# Altium project WHEY_AGR_AGR_VAI.PrjPcb
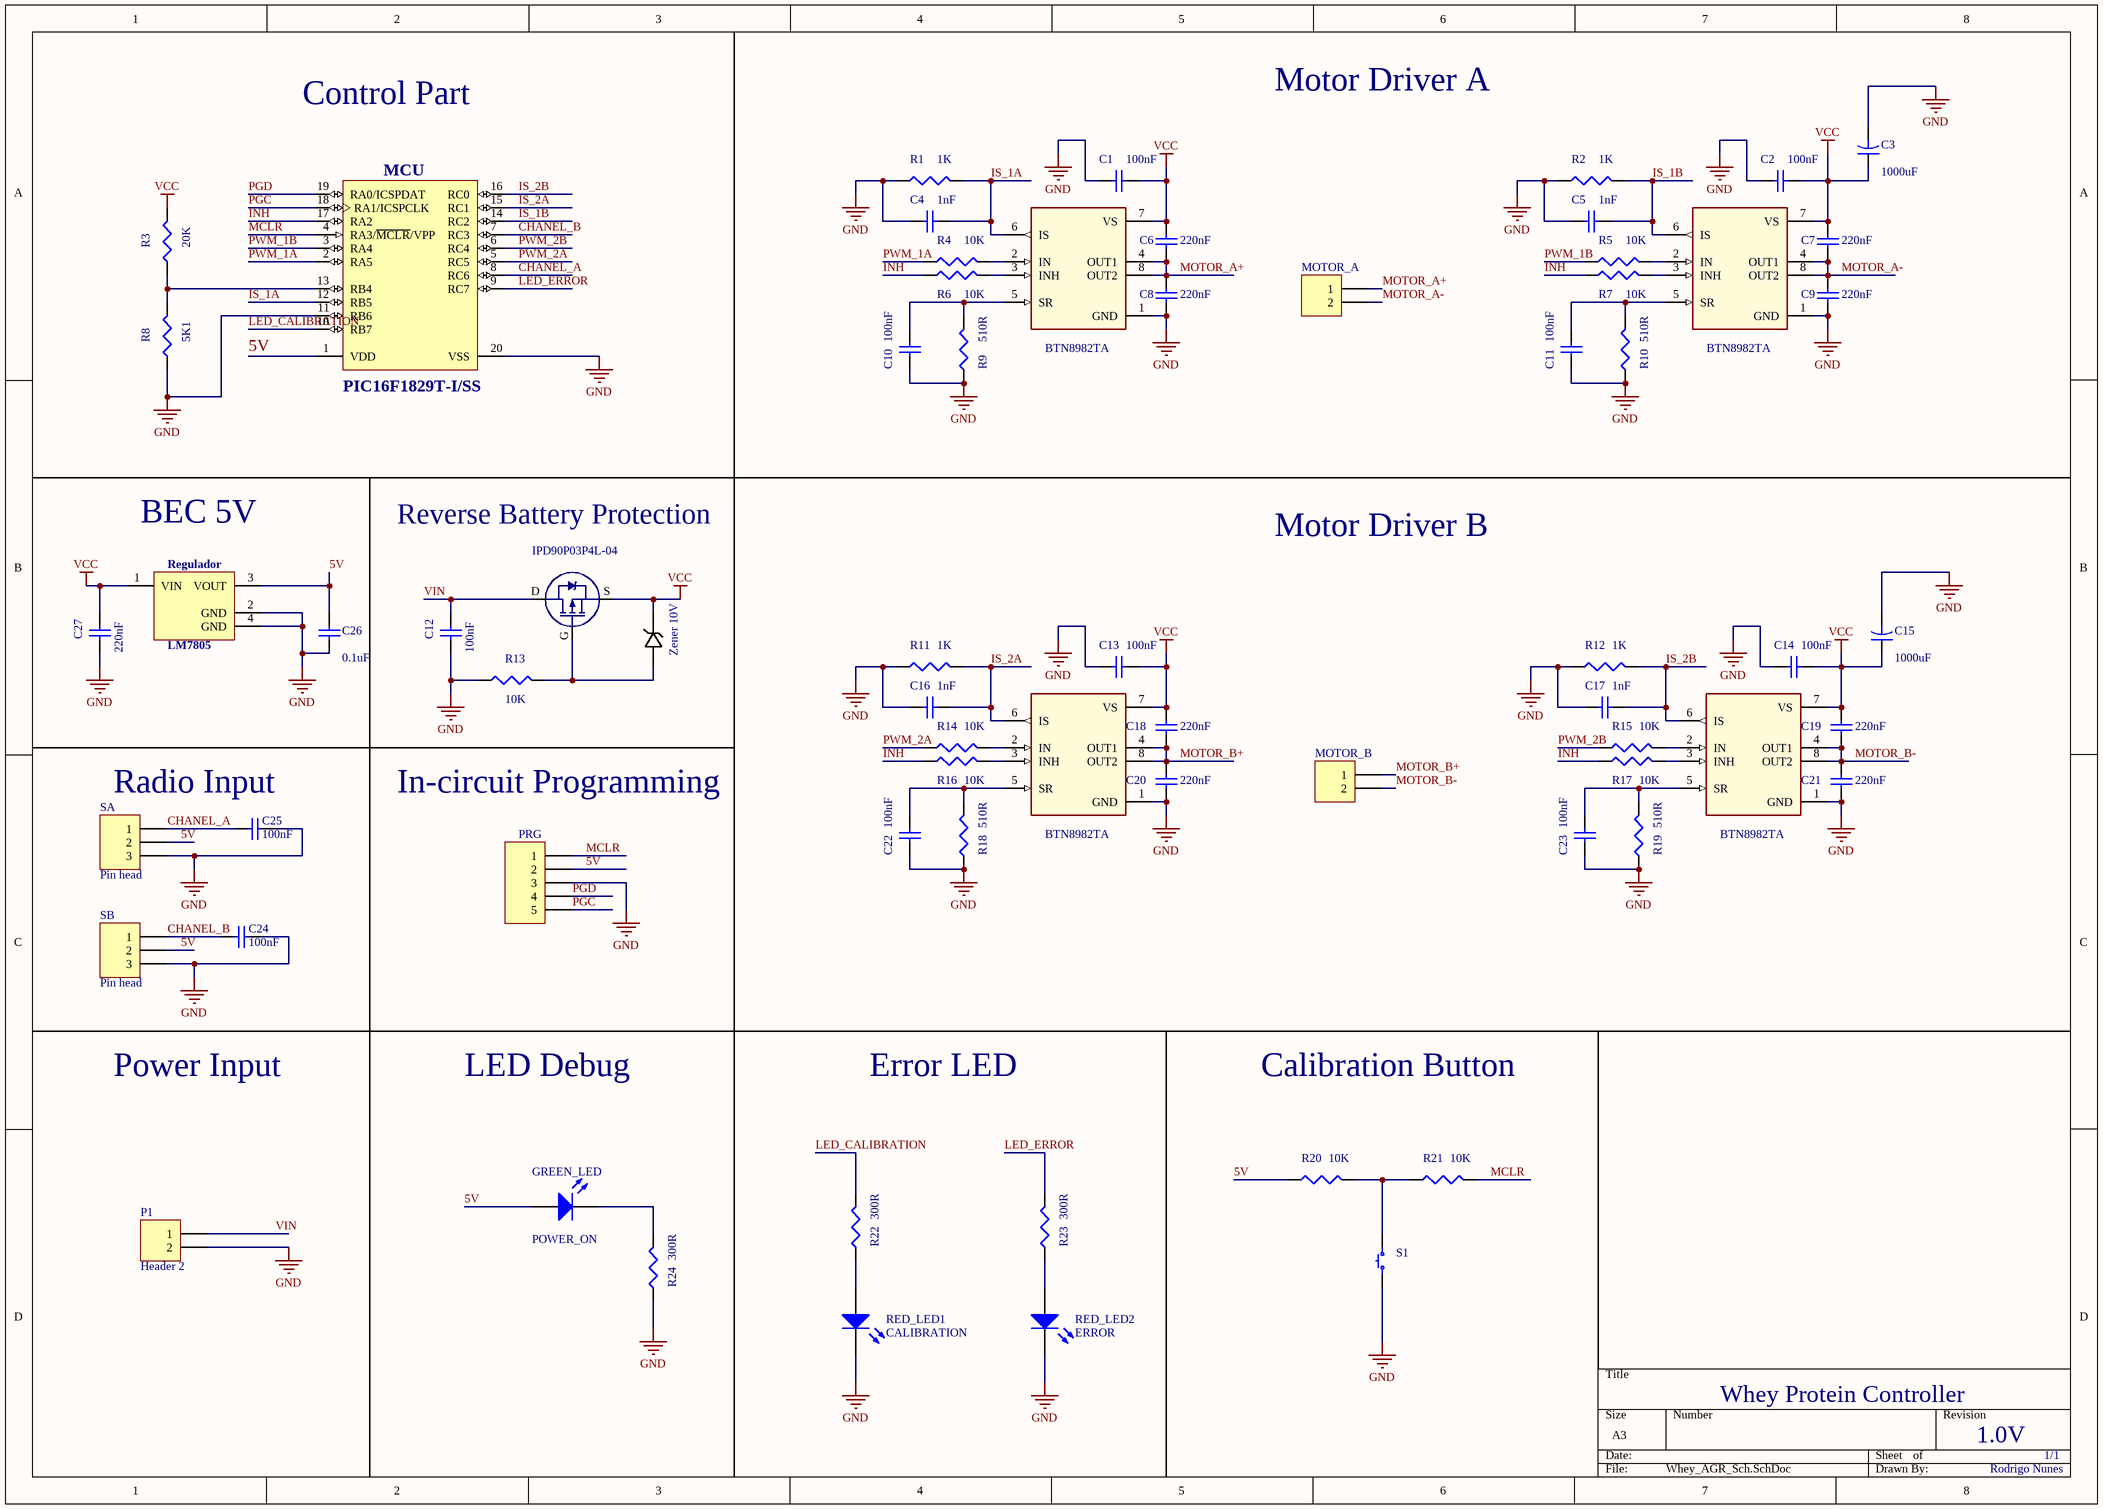
[diagram p0: Whey_AGR_Sch.SchDoc]
1 sheet, 69 parts. Net scope: global (net labels, ports and power ports of the same name join across sheets).
Board file: Whey_AGR_AGR_PCB.PcbDoc

## Sheet Whey_AGR_Sch.SchDoc
size A3

### Parts
C1  value 100nF  [C1206]  (hidden comment: Cap Semi)
C2  value 100nF  [C1206]  (hidden comment: Cap Semi)
C3  1000uF  [CAPR5-4X5]
C4  value 1nF  [C1206]  (hidden comment: Cap Semi)
C5  value 1nF  [C1206]  (hidden comment: Cap Semi)
C6  value 220nF  [C1206]  (hidden comment: Cap Semi)
C7  value 220nF  [C1206]  (hidden comment: Cap Semi)
C8  value 220nF  [C1206]  (hidden comment: Cap Semi)
C9  value 220nF  [C1206]  (hidden comment: Cap Semi)
C10  value 100nF  [C1206]  (hidden comment: Cap Semi)
C11  value 100nF  [C1206]  (hidden comment: Cap Semi)
C12  value 100nF  [C1206]  (hidden comment: Cap Semi)
C13  value 100nF  [C1206]  (hidden comment: Cap Semi)
C14  value 100nF  [C1206]  (hidden comment: Cap Semi)
C15  value 1000uF  [CAPR5-4X5]  (hidden comment: Cap2)
C16  value 1nF  [C1206]  (hidden comment: Cap Semi)
C17  value 1nF  [C1206]  (hidden comment: Cap Semi)
C18  value 220nF  [C1206]  (hidden comment: Cap Semi)
C19  value 220nF  [C1206]  (hidden comment: Cap Semi)
C20  value 220nF  [C1206]  (hidden comment: Cap Semi)
C21  value 220nF  [C1206]  (hidden comment: Cap Semi)
C22  value 100nF  [C1206]  (hidden comment: Cap Semi)
C23  value 100nF  [C1206]  (hidden comment: Cap Semi)
C24  value 100nF  [C1206]  (hidden comment: Cap Semi)
C25  value 100nF  [C1206]  (hidden comment: Cap Semi)
C26  value 0.1uF  [C1206]
C27  value 220nF  [C1206]  (hidden comment: Cap Semi)
GREEN_LED  POWER_ON  [3.2X1.6X1.1]
IPD90P03P4L-04  IPD50P04P4  [TO-252]  (value not drawn)
MCU  PIC16F1829T-I/SS  [MCHP-SSOP-SS20_N]
MOTOR_A  Header 2  [HDR1X2]  (value not drawn)
MOTOR_B  Header 2  [HDR1X2]  (value not drawn)
P1  Header 2  [HDR1X2]
PRG  Header 5  [HDR1X5]  (value not drawn)
R1  value 1K  [J1-0603]  (hidden comment: Res3)
R2  value 1K  [J1-0603]  (hidden comment: Res3)
R3  value 20K  [J1-0603]  (hidden comment: Res3)
R4  value 10K  [J1-0603]  (hidden comment: Res3)
R5  value 10K  [J1-0603]  (hidden comment: Res3)
R6  value 10K  [J1-0603]  (hidden comment: Res3)
R7  value 10K  [J1-0603]  (hidden comment: Res3)
R8  value 5K1  [J1-0603]  (hidden comment: Res3)
R9  value 510R  [J1-0603]  (hidden comment: Res3)
R10  value 510R  [J1-0603]  (hidden comment: Res3)
R11  value 1K  [J1-0603]  (hidden comment: Res3)
R12  value 1K  [J1-0603]  (hidden comment: Res3)
R13  value 10K  [J1-0603]  (hidden comment: Res3)
R14  value 10K  [J1-0603]  (hidden comment: Res3)
R15  value 10K  [J1-0603]  (hidden comment: Res3)
R16  value 10K  [J1-0603]  (hidden comment: Res3)
R17  value 10K  [J1-0603]  (hidden comment: Res3)
R18  value 510R  [J1-0603]  (hidden comment: Res3)
R19  value 510R  [J1-0603]  (hidden comment: Res3)
R20  value 10K  [J1-0603]  (hidden comment: Res3)
R21  value 10K  [J1-0603]  (hidden comment: Res3)
R22  value 300R  [J1-0603]  (hidden comment: Res3)
R23  value 300R  [J1-0603]  (hidden comment: Res3)
R24  value 300R  [J1-0603]  (hidden comment: Res3)
RED_LED1  CALIBRATION  [3.2X1.6X1.1]
RED_LED2  ERROR  [3.2X1.6X1.1]
Regulador  LM7805  [SOT223]
S1  FSMSMTR  [TE FSMSMTR]  (value not drawn)
SA  Pin head  [HDR1X3]
SB  Pin head  [HDR1X3]
U1  BTN8982TA  [TO127P1500X440-8N-1]
U2  BTN8982TA  [TO127P1500X440-8N-1]
U3  BTN8982TA  [TO127P1500X440-8N-1]
U4  BTN8982TA  [TO127P1500X440-8N-1]
Zener_10V  BZT52HC10WF-7  [SOD123]  (value not drawn)

### Nets
GND: C1.1 C2.1 C3.2 C4.1 C5.1 C8.1 C9.1 C10.1 C11.1 C12.1 C13.1 C14.1 C15.2 C16.1 C17.1 C20.1 C21.1 C22.1 C23.1 C24.1 C25.2 C26.2 C27.1 MCU.11(RB6) MCU.20(VSS) P1.2 PRG.3 R1.1 R2.1 R8.1 R9.1 R10.1 R11.1 R12.1 R13.1 R18.1 R19.1 R24.1 RED_LED1.2(K) RED_LED2.2(K) Regulador.2(GND) Regulador.4(GND) S1.1 SA.3 SB.3 U1.1(GND) U2.1(GND) U3.1(GND) U4.1(GND)
VCC: C1.2 C2.2 C3.1 C6.2 C7.2 C13.2 C14.2 C15.1 C18.2 C19.2 C27.2 IPD90P03P4L-04.S R3.2 Regulador.1(VIN) U1.7(VS) U2.7(VS) U3.7(VS) U4.7(VS) Zener_10V.K
5V: C26.1 GREEN_LED.1(A) MCU.1(VDD) PRG.2 R20.1 Regulador.3(VOUT) SA.2 SB.2
CHANEL_A: C25.1 MCU.8(RC6) SA.1
CHANEL_B: C24.2 MCU.7(RC3) SB.1
INH: MCU.17(RA2) R6.1 R7.1 R16.1 R17.1
IS_1A: C4.2 MCU.12(RB5) R1.2 U1.6(IS)
IS_1B: C5.2 MCU.14(RC2) R2.2 U2.6(IS)
IS_2A: C16.2 MCU.15(RC1) R11.2 U3.6(IS)
IS_2B: C17.2 MCU.16(RC0) R12.2 U4.6(IS)
LED_CALIBRATION: MCU.10(RB7) R22.2
LED_ERROR: MCU.9(RC7) R23.2
MCLR: MCU.4(RA3/~{MCLR}/VPP) PRG.1 R21.2
MOTOR_A+: C6.1 C8.2 MOTOR_A.1 U1.4(OUT1) U1.8(OUT2)
MOTOR_A-: C7.1 C9.2 MOTOR_A.2 U2.4(OUT1) U2.8(OUT2)
MOTOR_B+: C18.1 C20.2 MOTOR_B.1 U3.4(OUT1) U3.8(OUT2)
MOTOR_B-: C19.1 C21.2 MOTOR_B.2 U4.4(OUT1) U4.8(OUT2)
PGC: MCU.18(RA1/ICSPCLK) PRG.5
PGD: MCU.19(RA0/ICSPDAT) PRG.4
PWM_1A: MCU.2(RA5) R4.1
PWM_1B: MCU.3(RA4) R5.1
PWM_2A: MCU.5(RC5) R14.1
PWM_2B: MCU.6(RC4) R15.1
VIN: C12.2 IPD90P03P4L-04.D P1.1
NetC10_2: C10.2 R9.2 U1.5(SR)
NetC11_2: C11.2 R10.2 U2.5(SR)
NetC22_2: C22.2 R18.2 U3.5(SR)
NetC23_2: C23.2 R19.2 U4.5(SR)
NetGREEN_LED_2: GREEN_LED.2(K) R24.2
NetIPD90P03P4L-04_G: IPD90P03P4L-04.G R13.2 Zener_10V.A
NetMCU_13: MCU.13(RB4) R3.1 R8.2
NetR4_2: R4.2 U1.2(IN)
NetR5_2: R5.2 U2.2(IN)
NetR6_2: R6.2 U1.3(INH)
NetR7_2: R7.2 U2.3(INH)
NetR14_2: R14.2 U3.2(IN)
NetR15_2: R15.2 U4.2(IN)
NetR16_2: R16.2 U3.3(INH)
NetR17_2: R17.2 U4.3(INH)
NetR20_2: R20.2 R21.1 S1.2
NetR22_1: R22.1 RED_LED1.1(A)
NetR23_1: R23.1 RED_LED2.1(A)

### Notes on the sheet
- Control Part
- Motor Driver A
- BEC 5V
- Reverse Battery Protection
- Motor Driver B
- Radio Input
- In-circuit Programming
- Power Input
- LED Debug
- Error LED
- Calibration Button
- Whey Protein Controller
- 1.0V
- 1/1
- Rodrigo Nunes

### Library data of the parts
C1 C2 C4-C14 C16-C27 = Cap Semi: Capacitor (Semiconductor SIM Model); Published: 8-Jun-2000; LatestRevisionDate: 29-May-2009; LatestRevisionNote: IPC-7351 Footprint Added.; PackageReference: C1206; Publisher: Altium Limited; PackageDescription: Chip Capacitor
C3 C15 = Cap2: Capacitor; Published: 23-Sep-2002; PackageReference: CAPR5-4X5; Publisher: Altium Limited; PackageDescription: Capacitor; 2 Leads
  C3: Value: 1000uF
GREEN_LED RED_LED1 RED_LED2 = LED2: Typical RED, GREEN, YELLOW, AMBER GaAs LED; Published: 8-Jun-2000; LatestRevisionDate: 17-Jul-2002; LatestRevisionNote: Re-released for DXP Platform.; PackageVersion: Feb-2002; PackageReference: 3.2X1.6X1.1; Publisher: Altium Limited; PackageDescription: SM LED; 2 Flat Leads
IPD90P03P4L-04 = IPD50P04P4: MOSFET P-Ch -40V -50A DPAK-2 OptiMOS-P2; pin to pad: D>4 G>1 S>3
MCU = PIC16F1829T-I/SS: Flash Microcontroller with XLP Technology, 32 MHz, 17 I/O, -40 to 85 degC, 20-pin SSOP (SS20), Tape and Reel; Manufacturer: Microchip; # of A/D Channels: 12; Digital Communication: 1 -A/E/USART, 2 -MSSP(SPI/I2C); EEPROM Data Memory (bytes): 256; I/O Pins: 17; Internal Oscillator: 32 MHz, 31 kHz; Max. CPU Speed MHz: 32; Operation Voltage Range: 1.8V - 5.5V; Packing: T/R; Program Memory KBytes: 14; Program Memory KWords: 8; RAM: 1024; Timers: 4 - 8-bit, 1 - 16-bit; DatasheetVersion: Rev. C; PackageVersion: C04-072B, 12/2012; PackageReference: SSOP-SS20; PackageDescription: 20-Lead Plastic Shrink Small Outline, 5.3 x 7.2 mm Body, 0.65 mm Pitch; Supplier 1: Digi-Key; Supplier Part Number 1: PIC16F1829T-I/SS-ND; Supplier 2: Newark; Supplier Part Number 2: 82R4387; Supplier 3: Mouser; Supplier Part Number 3: 579-PIC16F1829T-I/SS; Memory Type: Flash; RoHS: TRUE; Mounting Technology: Surface Mount; PartNumber: PIC16F1829T-I/SS; ComponentLink1Description: Datasheet; ComponentLink1URL: http://ww1.microchip.com/downloads/en/DeviceDoc/41440C.pdf; ComponentLink2Description: Package Specification; ComponentLink2URL: http://www.microchip.com/stellent/groups/techpub_sg/documents/packagingspec/en012702.pdf; ComponentLink3Description: URL Link1; ComponentLink3URL: Product URL:http://www.microchip.com/datasheet/PIC16F1829
MOTOR_A MOTOR_B P1 = Header 2: Header, 2-Pin; LatestRevisionDate: 17-Jul-2002; LatestRevisionNote: Re-released for DXP Platform.; Publisher: Altium Limited
PRG = Header 5: Header, 5-Pin; LatestRevisionDate: 17-Jul-2002; LatestRevisionNote: Re-released for DXP Platform.; Publisher: Altium Limited
R1 R2 R4-R7 R11-R17 R20 R21 = Res3: Resistor; Published: 8-Jun-2000; LatestRevisionDate: 29-May-2009; LatestRevisionNote: IPC-7351 Footprint Added.; PackageReference: J1-0603; Publisher: Altium Limited; PackageDescription: Chip Resistor
R3 R8-R10 R18 R19 R22-R24 = Res3: Resistor_SMD; Published: 8-Jun-2000; LatestRevisionDate: 29-May-2009; LatestRevisionNote: IPC-7351 Footprint Added.; PackageReference: J1-0603; Publisher: Altium Limited; PackageDescription: Chip Resistor
Regulador = LM7805MP/NOPB: 5V Regulator, 3-Pin SOT-223, Extended Temperature, Tape and Reel; Published: 29-Jan-2009; DatasheetVersion: revA, Aug-2007; PackageVersion: revBB, Aug-2009; PackageReference: SOT-223-DB3; Publisher: Altium Limited; PackageDescription: 3-Lead Plastic Small Outline Transistor (DB) [SOT-223]; Supplier 1: Digi-Key; Supplier Part Number 1: MCP1824ST-1202E/DBTR-ND; Supplier 2: Digi-Key; Supplier Part Number 2: MCP1824ST-1202E/DBCT-ND; Supplier 3: Digi-Key; Supplier Part Number 3: MCP1824ST-1202E/DBDKR-ND; Supplier 4: Farnell; Supplier Part Number 4: 1675417; ComponentLink1Description: Datasheet; ComponentLink1URL: http://ww1.microchip.com/downloads/en/DeviceDoc/22070a.pdf; ComponentLink2Description: Packaging Specification; ComponentLink2URL: http://www.microchip.com/stellent/groups/techpub_sg/documents/packagingspec/en012702.pdf; ComponentLink3Description: Microchip.com Home; ComponentLink3URL: http://www.microchip.com/
S1 = FSMSMTR: SWITCH TACTILE SPST-NO 0.05A 24V; Manufacturer: TE Connectivity Alcoswitch Switches; Switch Function: Off-Mom; Contact Rating @ Voltage: 0.05A @ 24VDC; Actuator Type: Standard; Actuator Orientation: Top Actuated; Illumination: Non-Illuminated; Operating Force: 180gf; Switch Travel: 0.25mm; Mechanical Life: 20,000 Cycles; Part Number: FSMSMTR; PartId: 8251; Supplier 1: Digi-Key; Supplier Part Number 1: 450-1758-2-ND; ComponentLink1Description: Datasheet; ComponentLink1URL: http://www.te.com/commerce/DocumentDelivery/DDEController?Action=srchrtrv&DocNm=1437566-3&DocType=Customer+Drawing&DocLang=English; ComponentLink2Description: Digi-Key Listing; ComponentLink2URL: http://www.digikey.com/product-detail/en/FSMSMTR/450-1758-2-ND/529671; Price: 0.175; Circuit: SPST-NO; Illumination Voltage: -; Illumination Type, Colour: -; Operating Temperature: -35C ~ 85C
SA SB = Header 3: Header, 3-Pin; LatestRevisionDate: 17-Jul-2002; LatestRevisionNote: Re-released for DXP Platform.; Publisher: Altium Limited
U1-U4 = BTN8982TA: High Current PN Half Bridge NovalithIC; Manufacturer: Infineon Technologies; ManufacturerPartNumber: BTN8982TA; PackageReference: PG-TO263-7-1
Zener_10V = BZT52HC10WF-7: Diode Zener 10.6V 375 mW AEC-Q101